# EAGLE design nanobone (EAGLE 7.5.0)

## Sheet 1 of 3
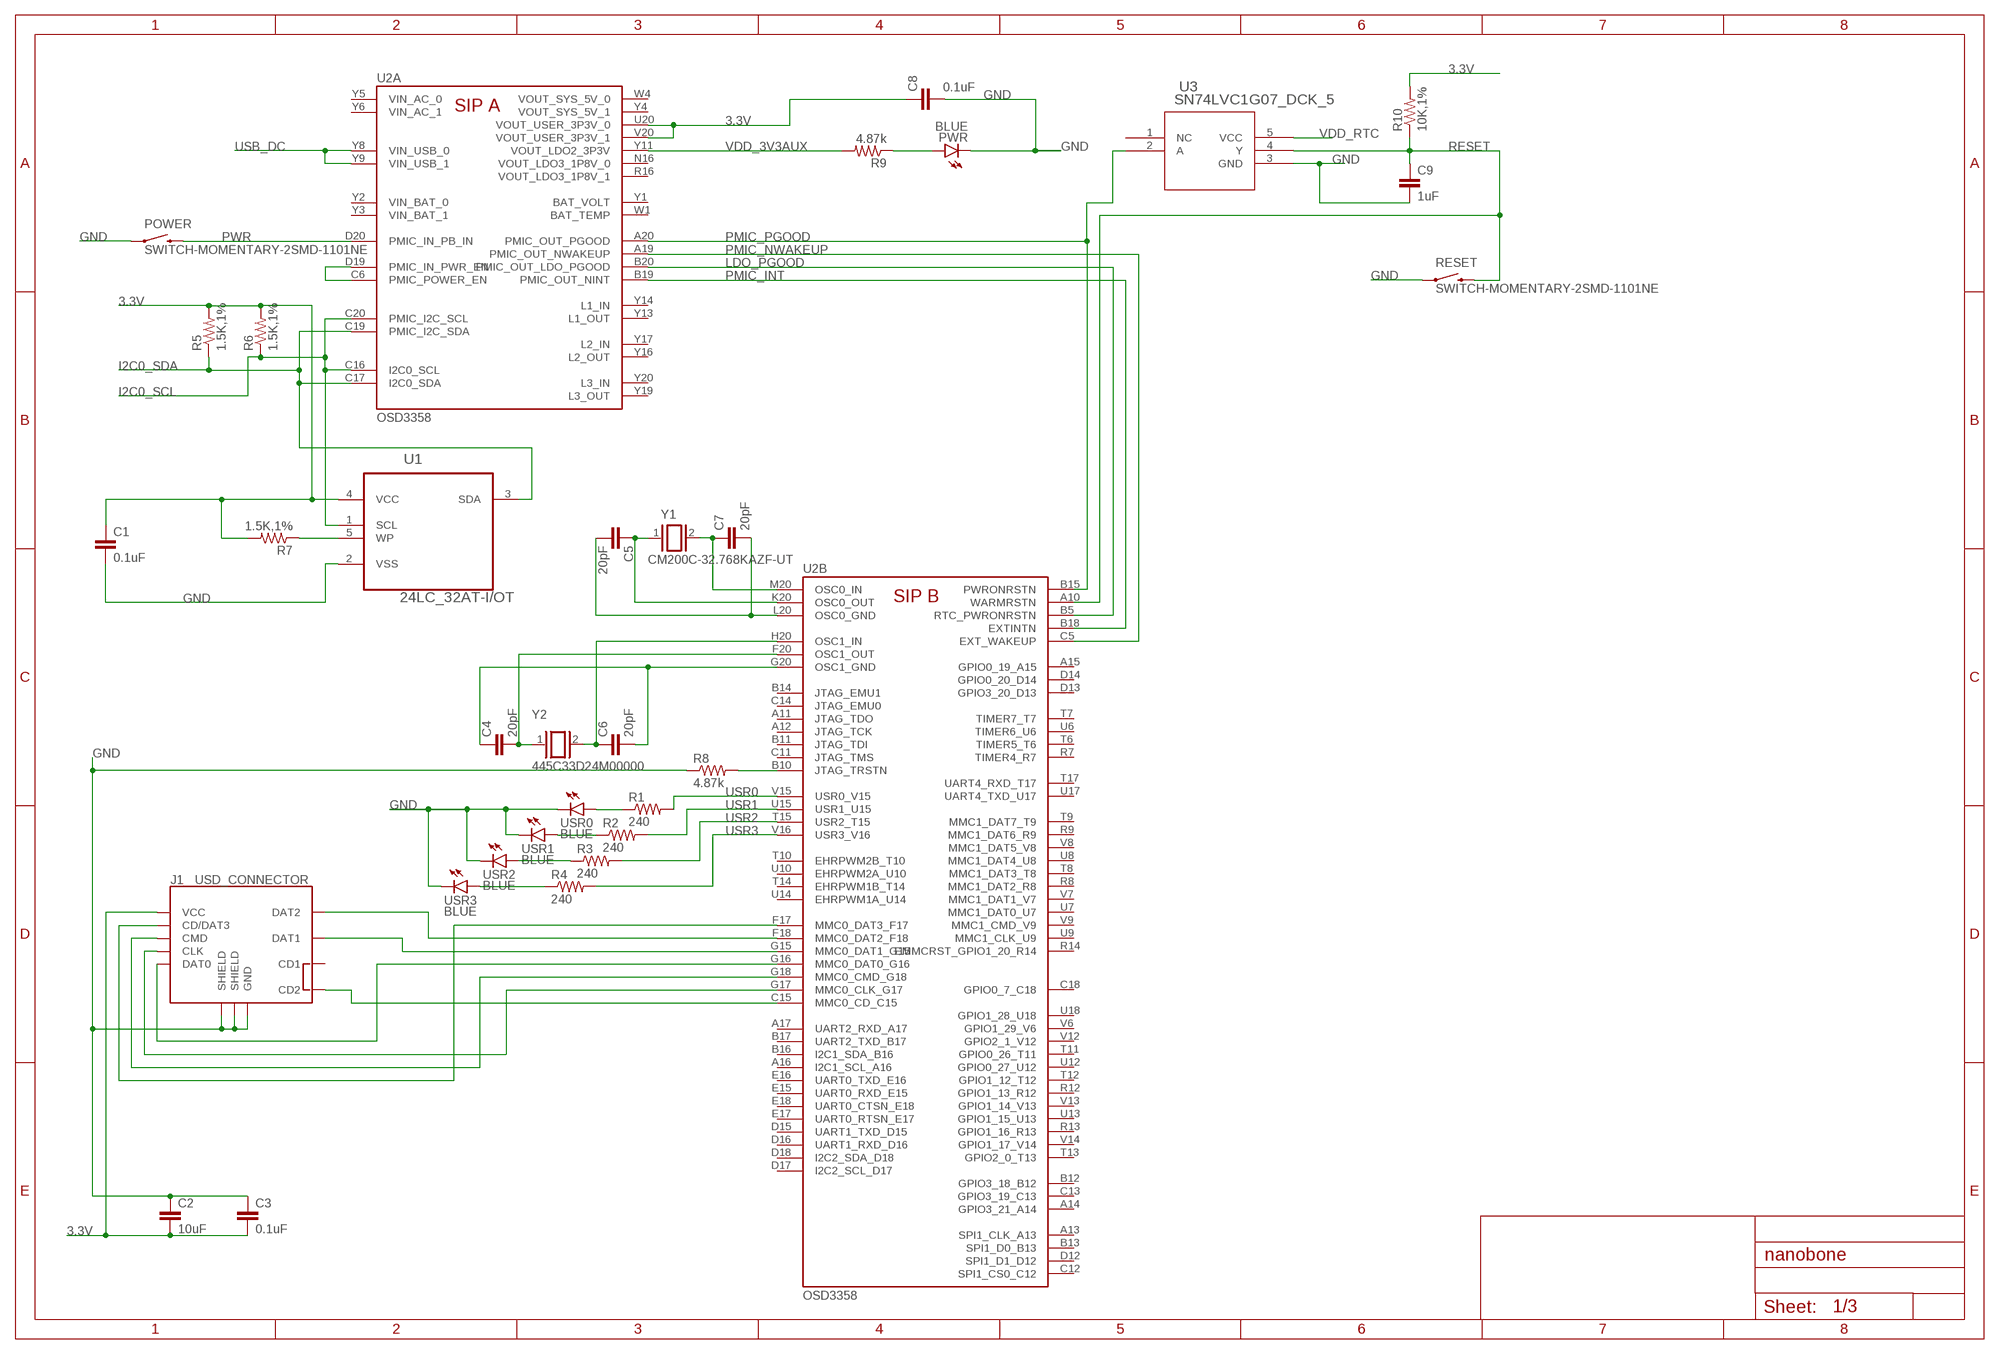
[diagram p0: schematic, sheet 1]

### Parts
C1  0.1uF  CAP0402-CAP  [0402-CAP]
C2  10uF  CAP0805  [0805]
C3  0.1uF  CAP0402-CAP  [0402-CAP]
C4  20pF  CAP0402-CAP  [0402-CAP]
C5  20pF  CAP0402-CAP  [0402-CAP]
C6  20pF  CAP0402-CAP  [0402-CAP]
C7  20pF  CAP0402-CAP  [0402-CAP]
C8  0.1uF  CAP0402-CAP  [0402-CAP]
C9  1uF  CAP0402-CAP  [0402-CAP]
J1  USD_CONNECTOR  [MICRO-SD-SOCKET-PP]
POWER  SWITCH-MOMENTARY-2SMD-1101NE  [TACTILE-SWITCH-1101NE]
PWR  BLUE  LED0402  [0402-LED]
R1  240  RESISTOR0402-RES  [0402-RES]
R2  240  RESISTOR0402-RES  [0402-RES]
R3  240  RESISTOR0402-RES  [0402-RES]
R4  240  RESISTOR0402-RES  [0402-RES]
R5  1.5K,1%  RESISTOR0402-RES  [0402-RES]
R6  1.5K,1%  RESISTOR0402-RES  [0402-RES]
R7  1.5K,1%  RESISTOR0402-RES  [0402-RES]
R8  4.87k  RESISTOR0402-RES  [0402-RES]
R9  4.87k  RESISTOR0402-RES  [0402-RES]
R10  10K,1%  RESISTOR0402-RES  [0402-RES]
RESET  SWITCH-MOMENTARY-2SMD-1101NE  [TACTILE-SWITCH-1101NE]
U1  24LC_32AT-I/OT  [SOT95P290X145-5N]
U2  OSD3358  [OSD3358]
U3  SN74LVC1G07_DCK_5  [DCK5]
USR0  BLUE  LED0402  [0402-LED]
USR1  BLUE  LED0402  [0402-LED]
USR2  BLUE  LED0402  [0402-LED]
USR3  BLUE  LED0402  [0402-LED]
Y1  CM200C-32.768KAZF-UT  [CM200C-32.768KAZF-UT]
Y2  445C33D24M00000  [445C33D24M00000]

### Nets
3.3V [power]: C1.1 C2.2 C3.2 C8.1 J1.VCC R5.2 R6.2 R7.2 R10.2 U1.4(VCC) U2.U20(A:VOUT_USER_3P3V_0) U2.V20(A:VOUT_USER_3P3V_1) ; also sheet 2
GND [ground]: C1.2 C2.1 C3.1 C8.2 C9.2 J1.GND J1.GND1(SHIELD) J1.GND3(SHIELD) POWER.1 PWR.C R8.1 RESET.1 U1.2(VSS) U3.3(GND) USR0.C USR1.C USR2.C USR3.C ; also sheet 2,3
I2C0_SCL: R6.1 U1.1(SCL) U2.C16(A:I2C0_SCL) U2.C20(A:PMIC_I2C_SCL)
I2C0_SDA: R5.1 U1.3(SDA) U2.C17(A:I2C0_SDA) U2.C19(A:PMIC_I2C_SDA)
LDO_PGOOD: U2.B5(B:RTC_PWRONRSTN) U2.B20(A:PMIC_OUT_LDO_PGOOD)
N$2: J1.CLK U2.G17(B:MMC0_CLK_G17)
N$5: J1.CD/DAT3 U2.F17(B:MMC0_DAT3_F17)
N$7: R8.2 U2.B10(B:JTAG_TRSTN)
N$8: R1.1 USR0.A
N$9: R2.1 USR1.A
N$10: R3.1 USR2.A
N$11: R4.1 USR3.A
N$12: U2.C6(A:PMIC_POWER_EN) U2.D19(A:PMIC_IN_PWR_EN)
N$13: PWR.A R9.1
N$26: C7.1 U2.M20(B:OSC0_IN) Y1.2
N$27: C5.1 U2.K20(B:OSC0_OUT) Y1.1
N$28: R7.1 U1.5(WP)
N$31: C5.2 C7.2 U2.L20(B:OSC0_GND)
N$32: C6.1 U2.H20(B:OSC1_IN) Y2.2
N$33: C4.2 U2.F20(B:OSC1_OUT) Y2.1
N$34: C4.1 C6.2 U2.G20(B:OSC1_GND)
N$70: J1.DAT1 U2.G15(B:MMC0_DAT1_G15)
N$74: J1.CMD U2.G18(B:MMC0_CMD_G18)
N$75: J1.CD2 U2.C15(B:MMC0_CD_C15)
N$77: J1.DAT0 U2.G16(B:MMC0_DAT0_G16)
NTE: J1.DAT2 U2.F18(B:MMC0_DAT2_F18)
PMIC_INT: U2.B18(B:EXTINTN) U2.B19(A:PMIC_OUT_NINT)
PMIC_NWAKEUP: U2.A19(A:PMIC_OUT_NWAKEUP) U2.C5(B:EXT_WAKEUP)
PMIC_PGOOD: U2.A20(A:PMIC_OUT_PGOOD) U2.B15(B:PWRONRSTN) U3.2(A)
PWR: POWER.2 U2.D20(A:PMIC_IN_PB_IN)
RESET: C9.1 R10.1 RESET.2 U2.A10(B:WARMRSTN) U3.4(Y)
USB_DC [power]: U2.Y8(A:VIN_USB_0) U2.Y9(A:VIN_USB_1) ; also sheet 2
USR0: R1.2 U2.V15(B:USR0_V15)
USR1: R2.2 U2.U15(B:USR1_U15)
USR2: R3.2 U2.T15(B:USR2_T15)
USR3: R4.2 U2.V16(B:USR3_V16)
VDD_3V3AUX: R9.2 U2.Y11(A:VOUT_LDO2_3P3V)
VDD_RTC: U3.5(VCC) ; also sheet 3
Unconnected: J1.CD1 U2.A11(B:JTAG_TDO) U2.A12(B:JTAG_TCK) U2.A13(B:SPI1_CLK_A13) U2.A14(B:GPIO3_21_A14) U2.A15(B:GPIO0_19_A15) U2.A16(B:I2C1_SCL_A16) U2.A17(B:UART2_RXD_A17) U2.B1(D:NC4) U2.B2(D:NC5) U2.B3(D:NC6) U2.B11(B:JTAG_TDI) U2.B12(B:GPIO3_18_B12) U2.B13(B:SPI1_D0_B13) U2.B14(B:JTAG_EMU1) U2.B16(B:I2C1_SDA_B16) U2.B17(B:UART2_TXD_B17) U2.C1(D:NC12) U2.C2(D:NC20) U2.C3(D:NC21) U2.C4(D:NC22) U2.C11(B:JTAG_TMS) U2.C12(B:SPI1_CS0_C12) U2.C13(B:GPIO3_19_C13) U2.C14(B:JTAG_EMU0) U2.C18(B:GPIO0_7_C18) U2.D1(D:NC24) U2.D2(D:NC31) U2.D3(D:NC32) U2.D4(D:NC33) U2.D5(D:NC34) U2.D12(B:SPI1_D1_D12) U2.D13(B:GPIO3_20_D13) U2.D14(B:GPIO0_20_D14) U2.D15(B:UART1_TXD_D15) U2.D16(B:UART1_RXD_D16) U2.D17(B:I2C2_SCL_D17) U2.D18(B:I2C2_SDA_D18) U2.E1(D:NC46) U2.E2(D:NC47) U2.E3(D:NC48) U2.E4(D:NC58) U2.E15(B:UART0_RXD_E15) U2.E16(B:UART0_TXD_E16) U2.E17(B:UART0_RTSN_E17) U2.E18(B:UART0_CTSN_E18) U2.F1(D:NC59) U2.F2(D:NC60) U2.F3(D:NC61) U2.F4(D:NC68) U2.G1(D:NC69) U2.G2(D:NC70) U2.G3(D:NC71) U2.G4(D:NC76) U2.H1(D:NC77) U2.H2(D:NC78) U2.H3(D:NC79) U2.H4(D:NC84) U2.J1(D:NC85) U2.J2(D:NC86) U2.J3(D:NC87) U2.J4(D:NC94) U2.K1(D:NC95) U2.K2(D:NC96) U2.K3(D:NC97) U2.K4(D:NC104) U2.L1(D:NC105) U2.L2(D:NC106) U2.L3(D:NC107) U2.L4(D:NC111) U2.M1(D:NC112) U2.M2(D:NC113) U2.M3(D:NC114) U2.M4(D:NC121) U2.N1(D:NC123) U2.N2(D:NC124) U2.N3(D:NC136) U2.N4(D:NC137) U2.P1(D:NC138) U2.P2(D:NC23) U2.P3(D:NC45) U2.P4(D:NC122) U2.R7(B:TIMER4_R7) U2.R8(B:MMC1_DAT2_R8) U2.R9(B:MMC1_DAT6_R9) U2.R12(B:GPIO1_13_R12) U2.R13(B:GPIO1_16_R13) U2.R14(B:EMMCRST_GPIO1_20_R14) U2.T6(B:TIMER5_T6) U2.T7(B:TIMER7_T7) U2.T8(B:MMC1_DAT3_T8) U2.T9(B:MMC1_DAT7_T9) U2.T10(B:EHRPWM2B_T10) U2.T11(B:GPIO0_26_T11) U2.T12(B:GPIO1_12_T12) U2.T13(B:GPIO2_0_T13) U2.T14(B:EHRPWM1B_T14) U2.T17(B:UART4_RXD_T17) U2.U6(B:TIMER6_U6) U2.U7(B:MMC1_DAT0_U7) U2.U8(B:MMC1_DAT4_U8) U2.U9(B:MMC1_CLK_U9) U2.U10(B:EHRPWM2A_U10) U2.U11(D:NC2) U2.U12(B:GPIO0_27_U12) U2.U13(B:GPIO1_15_U13) U2.U14(B:EHRPWM1A_U14) U2.U17(B:UART4_TXD_U17) U2.U18(B:GPIO1_28_U18) U2.V6(B:GPIO1_29_V6) U2.V7(B:MMC1_DAT1_V7) U2.V8(B:MMC1_DAT5_V8) U2.V9(B:MMC1_CMD_V9) U2.V10(D:NC3) U2.V11(D:NC1) U2.V12(B:GPIO2_1_V12) U2.V13(B:GPIO1_14_V13) U2.V14(B:GPIO1_17_V14) U2.W1(A:BAT_TEMP) U2.Y1(A:BAT_VOLT) U2.Y13(A:L1_OUT) U2.Y14(A:L1_IN) U2.Y16(A:L2_OUT) U2.Y17(A:L2_IN) U2.Y19(A:L3_OUT) U2.Y20(A:L3_IN) U3.1(NC)

## Sheet 2 of 3
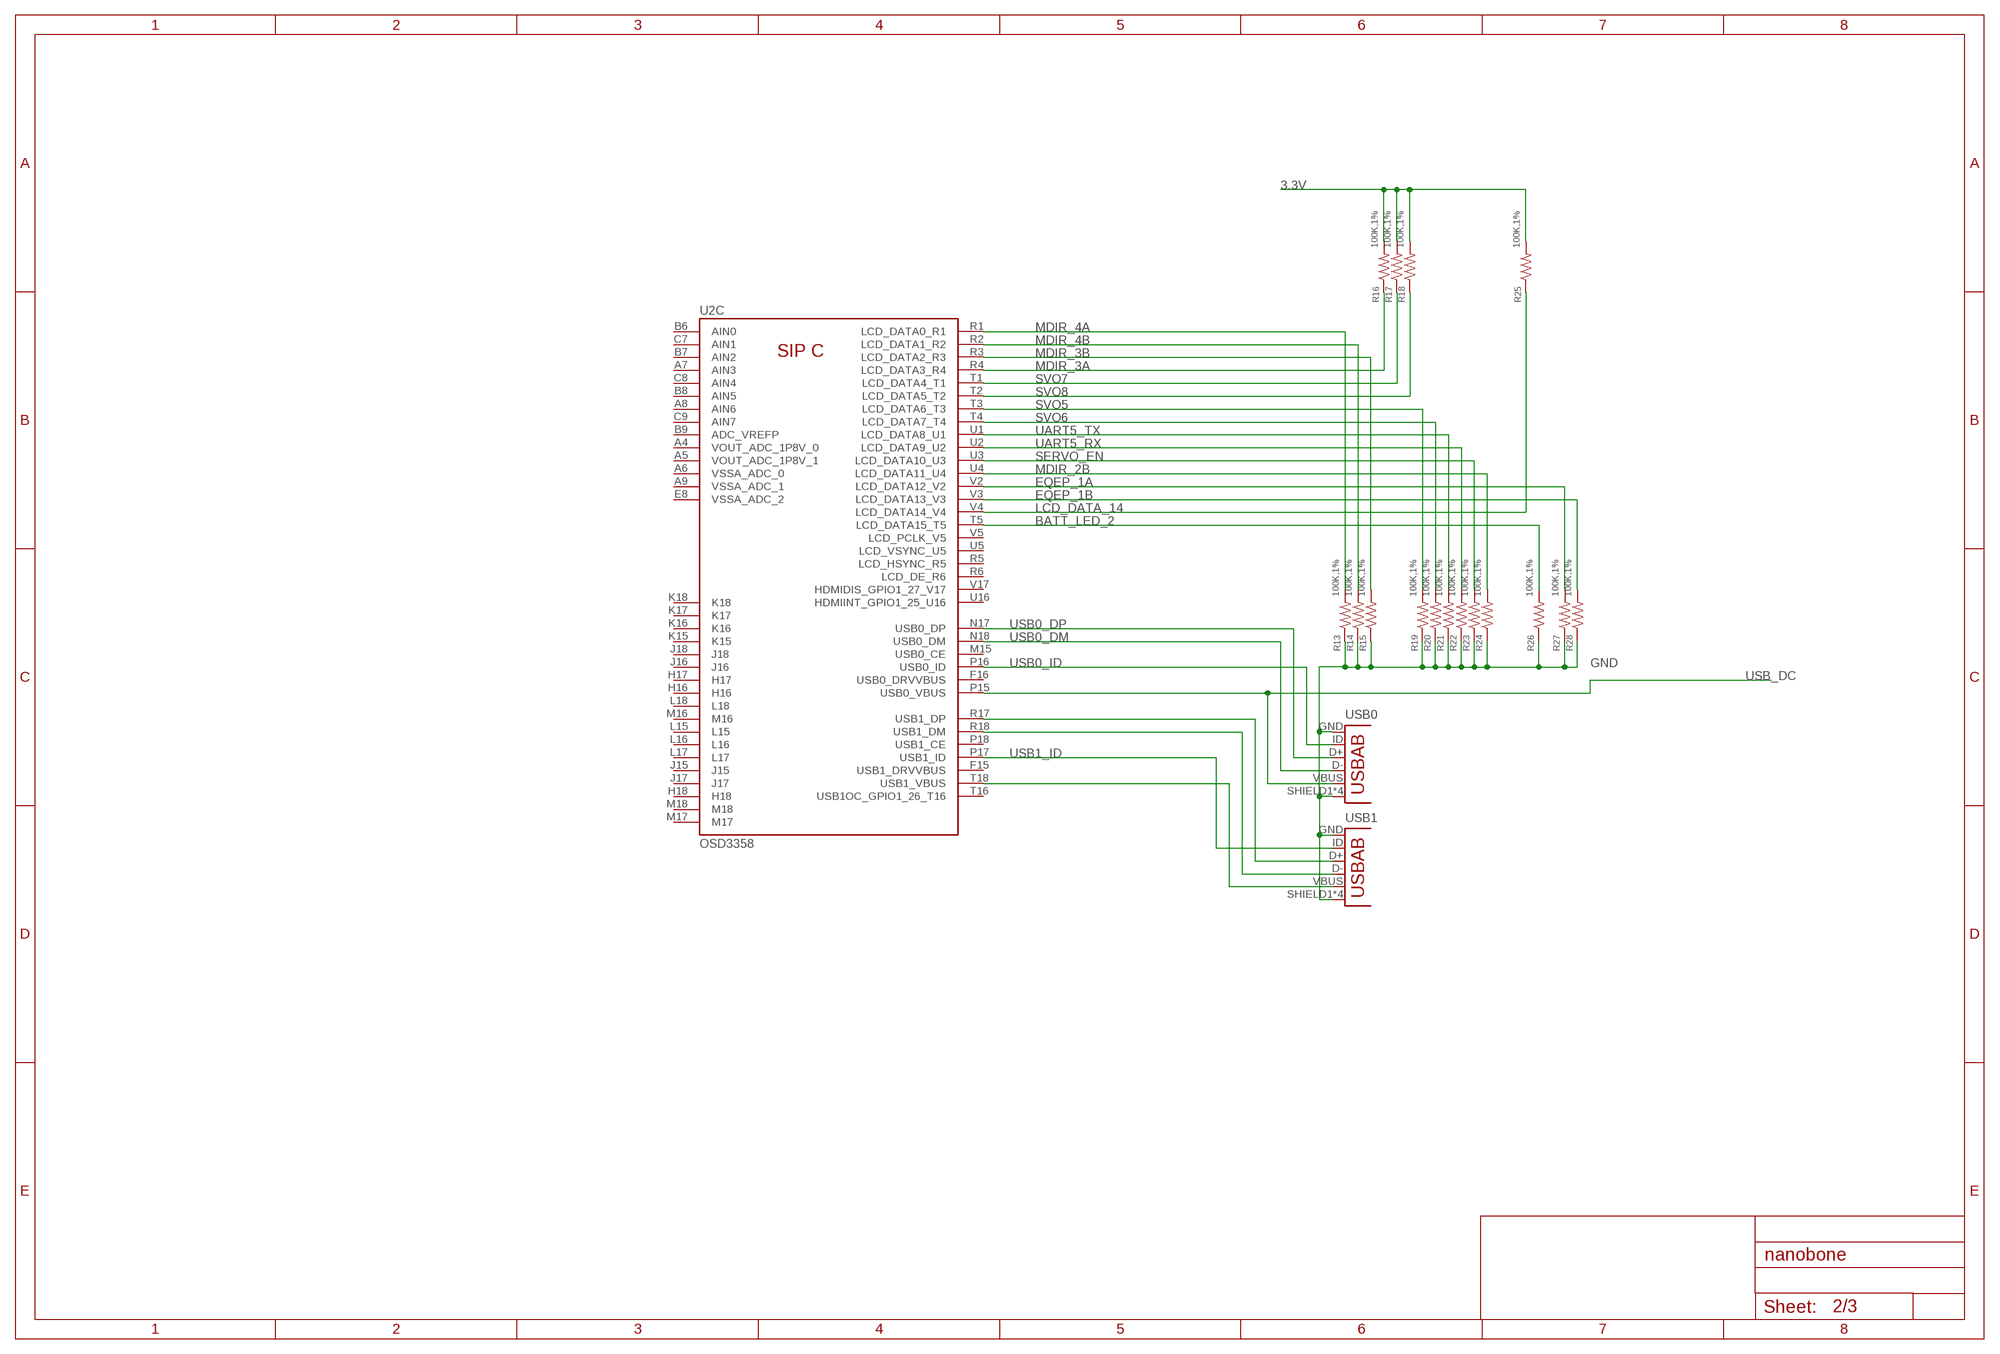
[diagram p1: schematic, sheet 2]

### Parts
R13  100K,1%  RESISTOR0402-RES  [0402-RES]
R14  100K,1%  RESISTOR0402-RES  [0402-RES]
R15  100K,1%  RESISTOR0402-RES  [0402-RES]
R16  100K,1%  RESISTOR0402-RES  [0402-RES]
R17  100K,1%  RESISTOR0402-RES  [0402-RES]
R18  100K,1%  RESISTOR0402-RES  [0402-RES]
R19  100K,1%  RESISTOR0402-RES  [0402-RES]
R20  100K,1%  RESISTOR0402-RES  [0402-RES]
R21  100K,1%  RESISTOR0402-RES  [0402-RES]
R22  100K,1%  RESISTOR0402-RES  [0402-RES]
R23  100K,1%  RESISTOR0402-RES  [0402-RES]
R24  100K,1%  RESISTOR0402-RES  [0402-RES]
R25  100K,1%  RESISTOR0402-RES  [0402-RES]
R26  100K,1%  RESISTOR0402-RES  [0402-RES]
R27  100K,1%  RESISTOR0402-RES  [0402-RES]
R28  100K,1%  RESISTOR0402-RES  [0402-RES]
USB0  USB-AB  [USB-AB-MICRO-SMD]
USB1  USB-AB  [USB-AB-MICRO-SMD]

### Nets
3.3V [power]: R16.2 R17.2 R18.2 R25.2 ; also sheet 1
BATT_LED_2: R26.2 U2.T5(C:LCD_DATA15_T5)
EQEP_1A: R27.2 U2.V2(C:LCD_DATA12_V2)
EQEP_1B: R28.2 U2.V3(C:LCD_DATA13_V3)
GND [ground]: R13.1 R14.1 R15.1 R19.1 R20.1 R21.1 R22.1 R23.1 R24.1 R26.1 R27.1 R28.1 USB0.GND USB0.SHIELD1(SHIELD) USB0.SHIELD2(SHIELD) USB0.SHIELD3(SHIELD) USB0.SHIELD4(SHIELD) USB1.GND USB1.SHIELD1(SHIELD) USB1.SHIELD2(SHIELD) USB1.SHIELD3(SHIELD) USB1.SHIELD4(SHIELD) ; also sheet 1,3
LCD_DATA_14: R25.1 U2.V4(C:LCD_DATA14_V4)
MDIR_2B: R24.2 U2.U4(C:LCD_DATA11_U4)
MDIR_3A: R16.1 U2.R4(C:LCD_DATA3_R4)
MDIR_3B: R15.2 U2.R3(C:LCD_DATA2_R3)
MDIR_4A: R13.2 U2.R1(C:LCD_DATA0_R1)
MDIR_4B: R14.2 U2.R2(C:LCD_DATA1_R2)
N$1: U2.R17(C:USB1_DP) USB1.D+
N$4: U2.R18(C:USB1_DM) USB1.D-
N$6: U2.T18(C:USB1_VBUS) USB1.VBUS
SERVO_EN: R23.2 U2.U3(C:LCD_DATA10_U3)
SVO5: R19.2 U2.T3(C:LCD_DATA6_T3)
SVO6: R20.2 U2.T4(C:LCD_DATA7_T4)
SVO7: R17.1 U2.T1(C:LCD_DATA4_T1)
SVO8: R18.1 U2.T2(C:LCD_DATA5_T2)
UART5_RX: R22.2 U2.U2(C:LCD_DATA9_U2)
UART5_TX: R21.2 U2.U1(C:LCD_DATA8_U1)
USB0_DM [usb]: U2.N18(C:USB0_DM) USB0.D-
USB0_DP [usb]: U2.N17(C:USB0_DP) USB0.D+
USB0_ID: U2.P16(C:USB0_ID) USB0.ID(USBID)
USB1_ID: U2.P17(C:USB1_ID) USB1.ID(USBID)
USB_DC [power]: U2.P15(C:USB0_VBUS) USB0.VBUS ; also sheet 1
Unconnected: U2.A4(C:VOUT_ADC_1P8V_0) U2.A5(C:VOUT_ADC_1P8V_1) U2.A6(C:VSSA_ADC_0) U2.A7(C:AIN3) U2.A8(C:AIN6) U2.A9(C:VSSA_ADC_1) U2.B6(C:AIN0) U2.B7(C:AIN2) U2.B8(C:AIN5) U2.B9(C:ADC_VREFP) U2.C7(C:AIN1) U2.C8(C:AIN4) U2.C9(C:AIN7) U2.E8(C:VSSA_ADC_2) U2.F15(C:USB1_DRVVBUS) U2.F16(C:USB0_DRVVBUS) U2.H16(C:H16) U2.H17(C:H17) U2.H18(C:H18) U2.J15(C:J15) U2.J16(C:J16) U2.J17(C:J17) U2.J18(C:J18) U2.K15(C:K15) U2.K16(C:K16) U2.K17(C:K17) U2.K18(C:K18) U2.L15(C:L15) U2.L16(C:L16) U2.L17(C:L17) U2.L18(C:L18) U2.M15(C:USB0_CE) U2.M16(C:M16) U2.M17(C:M17) U2.M18(C:M18) U2.P18(C:USB1_CE) U2.R5(C:LCD_HSYNC_R5) U2.R6(C:LCD_DE_R6) U2.T16(C:USB1OC_GPIO1_26_T16) U2.U5(C:LCD_VSYNC_U5) U2.U16(C:HDMIINT_GPIO1_25_U16) U2.V5(C:LCD_PCLK_V5) U2.V17(C:HDMIDIS_GPIO1_27_V17)

## Sheet 3 of 3
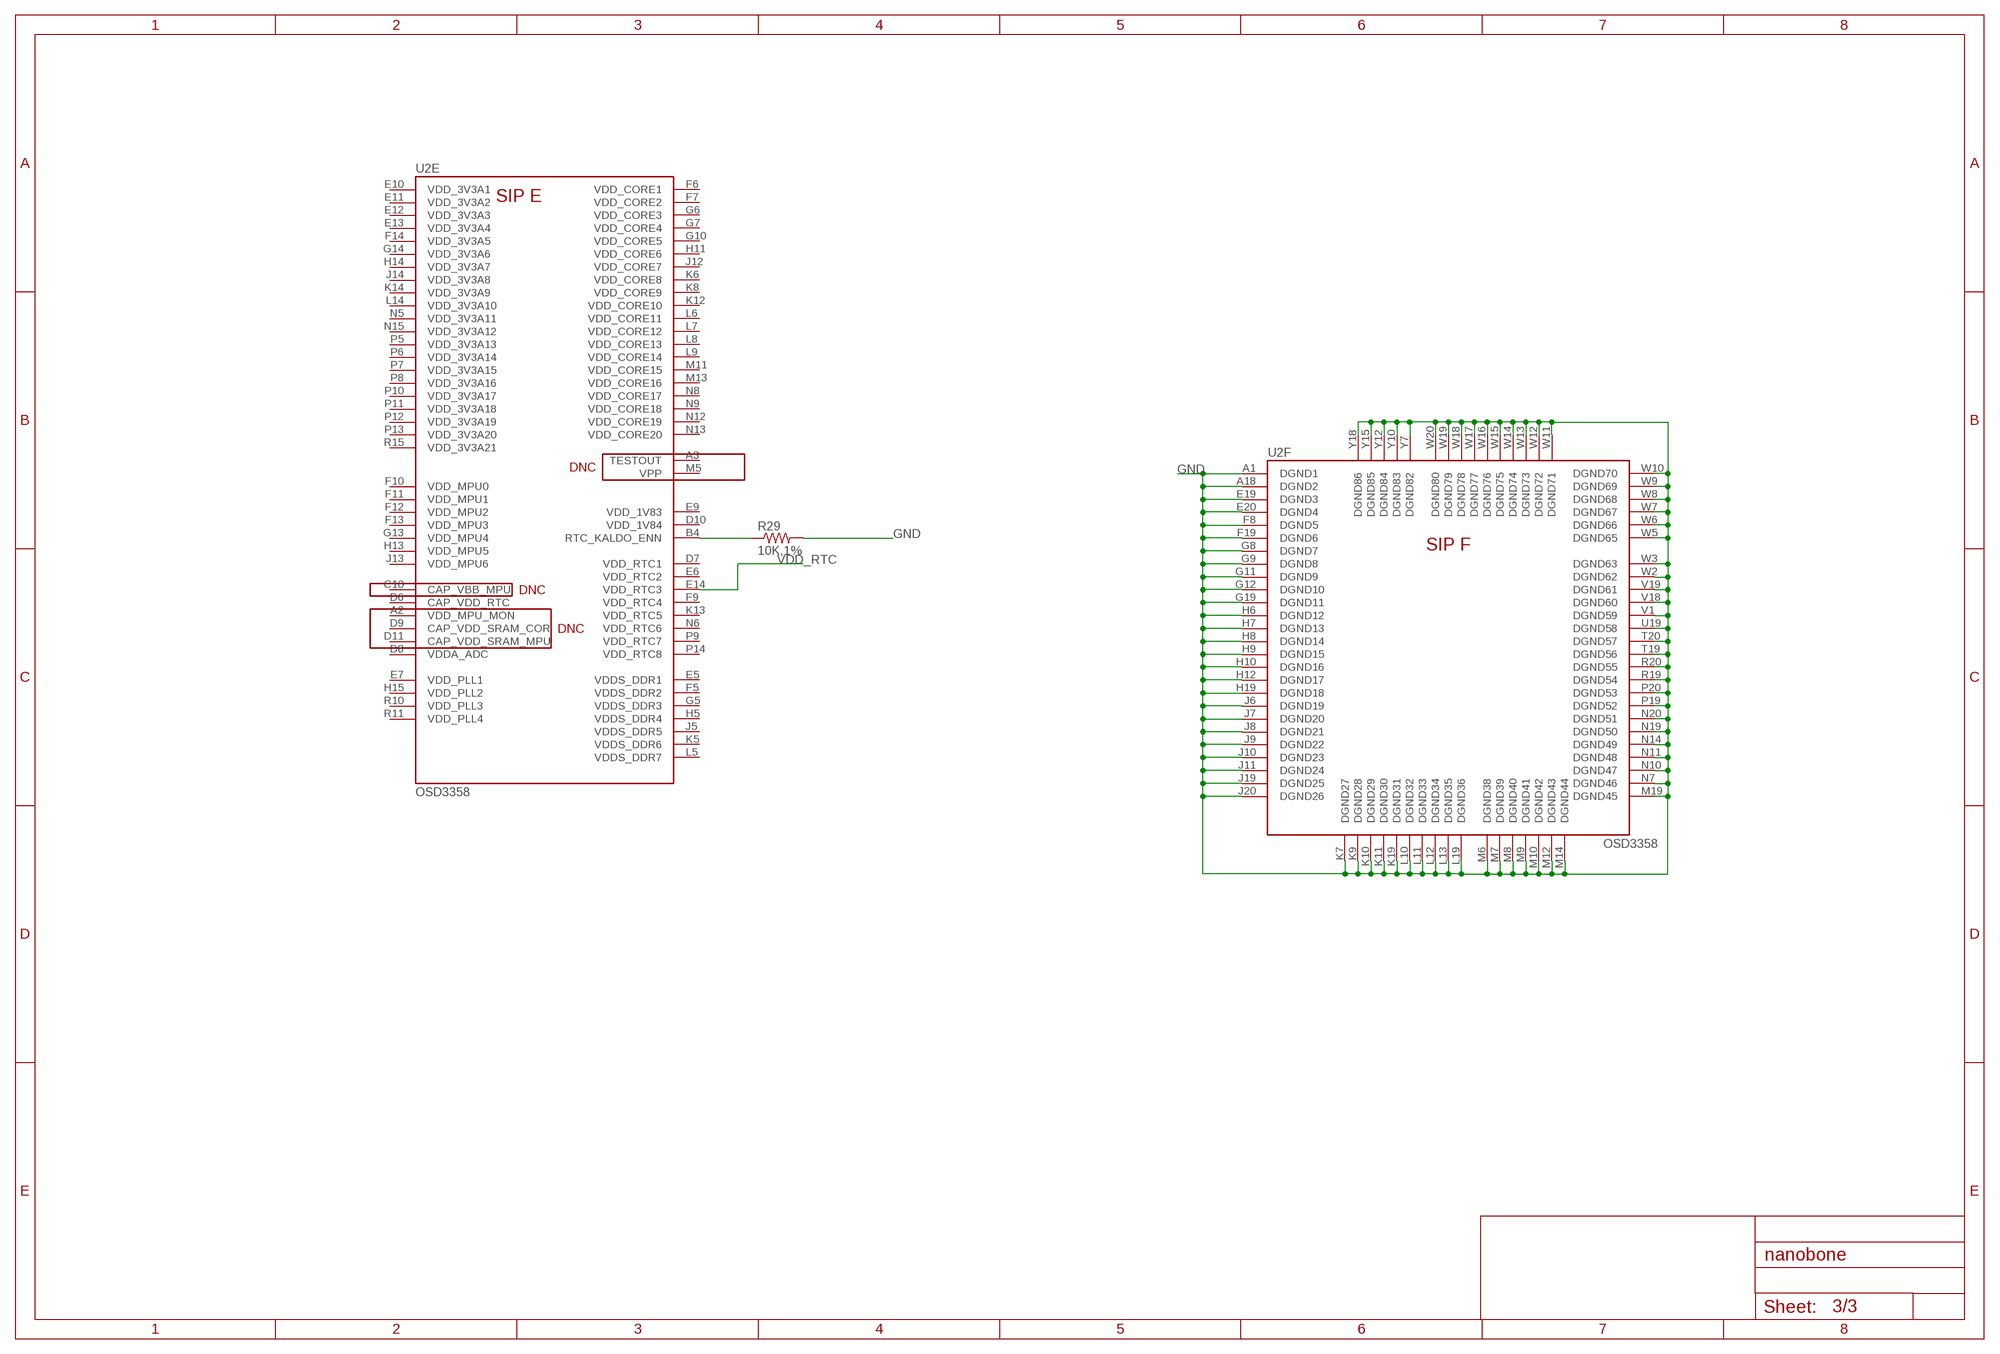
[diagram p2: schematic, sheet 3]

### Parts
R29  10K,1%  RESISTOR0402-RES  [0402-RES]

### Nets
GND [ground]: R29.2 U2.A1(F:DGND1) U2.A18(F:DGND2) U2.E19(F:DGND3) U2.E20(F:DGND4) U2.F8(F:DGND5) U2.F19(F:DGND6) U2.G8(F:DGND7) U2.G9(F:DGND8) U2.G11(F:DGND9) U2.G12(F:DGND10) U2.G19(F:DGND11) U2.H6(F:DGND12) U2.H7(F:DGND13) U2.H8(F:DGND14) U2.H9(F:DGND15) U2.H10(F:DGND16) U2.H12(F:DGND17) U2.H19(F:DGND18) U2.J6(F:DGND19) U2.J7(F:DGND20) U2.J8(F:DGND21) U2.J9(F:DGND22) U2.J10(F:DGND23) U2.J11(F:DGND24) U2.J19(F:DGND25) U2.J20(F:DGND26) U2.K7(F:DGND27) U2.K9(F:DGND28) U2.K10(F:DGND29) U2.K11(F:DGND30) U2.K19(F:DGND31) U2.L10(F:DGND32) U2.L11(F:DGND33) U2.L12(F:DGND34) U2.L13(F:DGND35) U2.L19(F:DGND36) U2.M6(F:DGND38) U2.M7(F:DGND39) U2.M8(F:DGND40) U2.M9(F:DGND41) U2.M10(F:DGND42) U2.M12(F:DGND43) U2.M14(F:DGND44) U2.M19(F:DGND45) U2.N7(F:DGND46) U2.N10(F:DGND47) U2.N11(F:DGND48) U2.N14(F:DGND49) U2.N19(F:DGND50) U2.N20(F:DGND51) U2.P19(F:DGND52) U2.P20(F:DGND53) U2.R19(F:DGND54) U2.R20(F:DGND55) U2.T19(F:DGND56) U2.T20(F:DGND57) U2.U19(F:DGND58) U2.V1(F:DGND59) U2.V18(F:DGND60) U2.V19(F:DGND61) U2.W2(F:DGND62) U2.W3(F:DGND63) U2.W5(F:DGND65) U2.W6(F:DGND66) U2.W7(F:DGND67) U2.W8(F:DGND68) U2.W9(F:DGND69) U2.W10(F:DGND70) U2.W11(F:DGND71) U2.W12(F:DGND72) U2.W13(F:DGND73) U2.W14(F:DGND74) U2.W15(F:DGND75) U2.W16(F:DGND76) U2.W17(F:DGND77) U2.W18(F:DGND78) U2.W19(F:DGND79) U2.W20(F:DGND80) U2.Y7(F:DGND82) U2.Y10(F:DGND83) U2.Y12(F:DGND84) U2.Y15(F:DGND85) U2.Y18(F:DGND86) ; also sheet 1,2
N$131: R29.1 U2.B4(E:RTC_KALDO_ENN)
VDD_RTC: U2.E14(E:VDD_RTC3) ; also sheet 1
Unconnected: U2.A2(E:VDD_MPU_MON) U2.A3(E:TESTOUT) U2.C10(E:CAP_VBB_MPU) U2.D6(E:CAP_VDD_RTC) U2.D7(E:VDD_RTC1) U2.D8(E:VDDA_ADC) U2.D9(E:CAP_VDD_SRAM_COR) U2.D10(E:VDD_1V84) U2.D11(E:CAP_VDD_SRAM_MPU) U2.E5(E:VDDS_DDR1) U2.E6(E:VDD_RTC2) U2.E7(E:VDD_PLL1) U2.E9(E:VDD_1V83) U2.E10(E:VDD_3V3A1) U2.E11(E:VDD_3V3A2) U2.E12(E:VDD_3V3A3) U2.E13(E:VDD_3V3A4) U2.F5(E:VDDS_DDR2) U2.F6(E:VDD_CORE1) U2.F7(E:VDD_CORE2) U2.F9(E:VDD_RTC4) U2.F10(E:VDD_MPU0) U2.F11(E:VDD_MPU1) U2.F12(E:VDD_MPU2) U2.F13(E:VDD_MPU3) U2.F14(E:VDD_3V3A5) U2.G5(E:VDDS_DDR3) U2.G6(E:VDD_CORE3) U2.G7(E:VDD_CORE4) U2.G10(E:VDD_CORE5) U2.G13(E:VDD_MPU4) U2.G14(E:VDD_3V3A6) U2.H5(E:VDDS_DDR4) U2.H11(E:VDD_CORE6) U2.H13(E:VDD_MPU5) U2.H14(E:VDD_3V3A7) U2.H15(E:VDD_PLL2) U2.J5(E:VDDS_DDR5) U2.J12(E:VDD_CORE7) U2.J13(E:VDD_MPU6) U2.J14(E:VDD_3V3A8) U2.K5(E:VDDS_DDR6) U2.K6(E:VDD_CORE8) U2.K8(E:VDD_CORE9) U2.K12(E:VDD_CORE10) U2.K13(E:VDD_RTC5) U2.K14(E:VDD_3V3A9) U2.L5(E:VDDS_DDR7) U2.L6(E:VDD_CORE11) U2.L7(E:VDD_CORE12) U2.L8(E:VDD_CORE13) U2.L9(E:VDD_CORE14) U2.L14(E:VDD_3V3A10) U2.M5(E:VPP) U2.M11(E:VDD_CORE15) U2.M13(E:VDD_CORE16) U2.N5(E:VDD_3V3A11) U2.N6(E:VDD_RTC6) U2.N8(E:VDD_CORE17) U2.N9(E:VDD_CORE18) U2.N12(E:VDD_CORE19) U2.N13(E:VDD_CORE20) U2.N15(E:VDD_3V3A12) U2.P5(E:VDD_3V3A13) U2.P6(E:VDD_3V3A14) U2.P7(E:VDD_3V3A15) U2.P8(E:VDD_3V3A16) U2.P9(E:VDD_RTC7) U2.P10(E:VDD_3V3A17) U2.P11(E:VDD_3V3A18) U2.P12(E:VDD_3V3A19) U2.P13(E:VDD_3V3A20) U2.P14(E:VDD_RTC8) U2.R10(E:VDD_PLL3) U2.R11(E:VDD_PLL4) U2.R15(E:VDD_3V3A21)

## Power pins joined to a net without a drawn wire
VIN_AC_0: U2.Y5(A:VIN_AC_0)
VIN_AC_1: U2.Y6(A:VIN_AC_1)
VIN_BAT_0: U2.Y2(A:VIN_BAT_0)
VIN_BAT_1: U2.Y3(A:VIN_BAT_1)
VOUT_LDO3_1P8V_0: U2.N16(A:VOUT_LDO3_1P8V_0)
VOUT_LDO3_1P8V_1: U2.R16(A:VOUT_LDO3_1P8V_1)
VOUT_SYS_5V_0: U2.W4(A:VOUT_SYS_5V_0)
VOUT_SYS_5V_1: U2.Y4(A:VOUT_SYS_5V_1)

## Library data of the parts
C1-C9 = Strawson_Eagle_Lib:CAP: Capacitor Standard 0603 ceramic capacitor, and 0.1" leaded capacitor.
J1 = pocketbone:USD_CONNECTOR: microSD Socket Push-push type µSD socket. Footprint production proven. Symbol has new and improved layout and naming accuracy. SparkFun Electronics SKU : PRT-00127. tDoc lines correctly indicate media card edge positions when inserting (unlocked, locked, depressed). NOTE: CD1 and CD2 are connected internally; PROD_ID: CONN-07820
POWER RESET = SparkFun-Electromechanical:SWITCH-MOMENTARY-2: Various NO switches- pushbuttons, reed, etc; PROD_ID: SWCH-00815
PWR USR0 USR1-USR3 = nanobone:LED: LEDs Standard schematic elements and footprints for 5mm, 3mm, 1206, and 0603 sized LEDs. 5mm - Spark Fun Electronics SKU : COM-00529 (and others)
R1-R10 R13-R29 = Strawson_Eagle_Lib:RESISTOR: Resistor Basic schematic elements and footprints for 0603, 1206, and PTH resistors.
U1 = pocketbone:24LC_: IC, I2C Serial EEPROM,SOT-23-5; MPN: 24LC32AT-I/OT; OC_FARNELL: 1700993; OC_NEWARK: 08P0113; PACKAGE: SOT-23-5; SUPPLIER: MICROCHIP
U2 = pocketbone:OSD3358: Octavo Systems LLC - OSD3358 Rev A
U3 = pocketbone:SN74LVC1G07_DCK_5; DATASHEETURL: http://www.ti.com/lit/gpn/SN74LVC1G07; DESCRIPTION: Single Buffer/Driver With Open-Drain Output; FAMILY_NAME: LL BUFFER AND DRIVER WITH OPEN-DRAIN OUTPUT; GENERIC_PART_NUMBER: SN74LVC1G07; INDUSTRY_STD_PKG_TYPE: SC70; MANUFACTURER: Texas Instruments; MANUFACTURER_PART_NUMBER: sn74lvc1g07_dck_5; PACKAGE_DESIGNATOR: DCK; PIN_COUNT: 5; VENDOR: Texas Instruments
USB0 USB1 = pocketbone:USB-AB: This is a USB AB connector that is compatible with USB OTG. i.e. this connector can serve as a host or device
Y1 = pocketbone:CM200C-32.768KAZF-UT
Y2 = pocketbone:445C33D24M00000

## Net classes
0 default: width 0.152 mm, drill 0.33 mm, clearance 0.152 mm
1 ground: width 0.33 mm, drill 0.33 mm, clearance 0.152 mm
2 usb: width 0.152 mm, clearance 0.152 mm
3 power: width 0.33 mm, drill 0.33 mm, clearance 0.152 mm

## Board
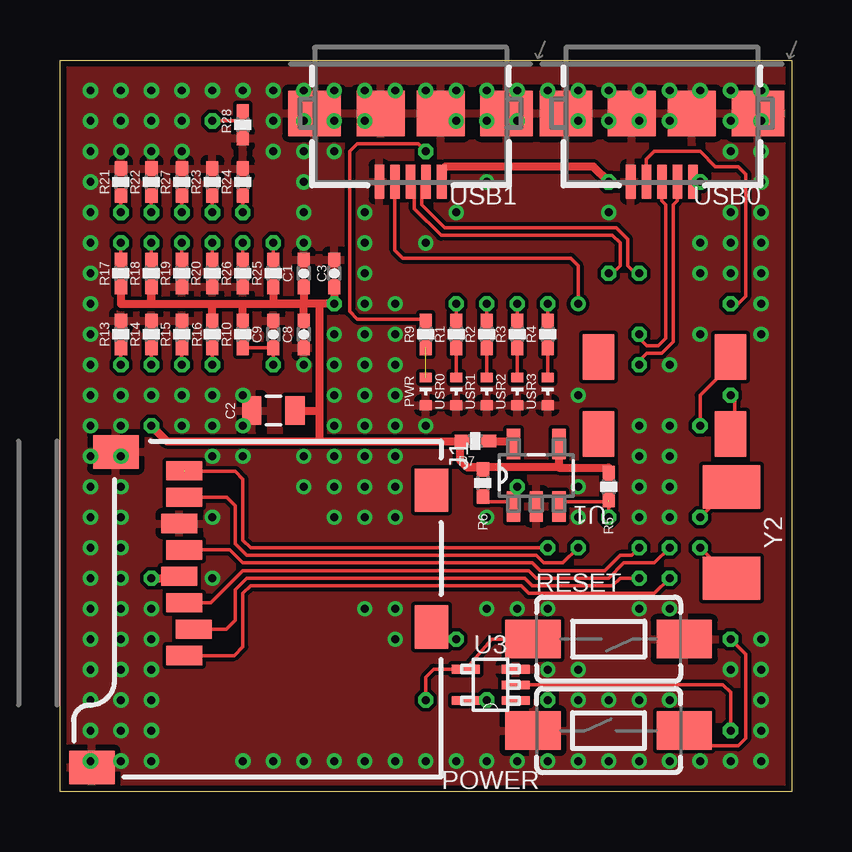
[diagram p3: board, top side]
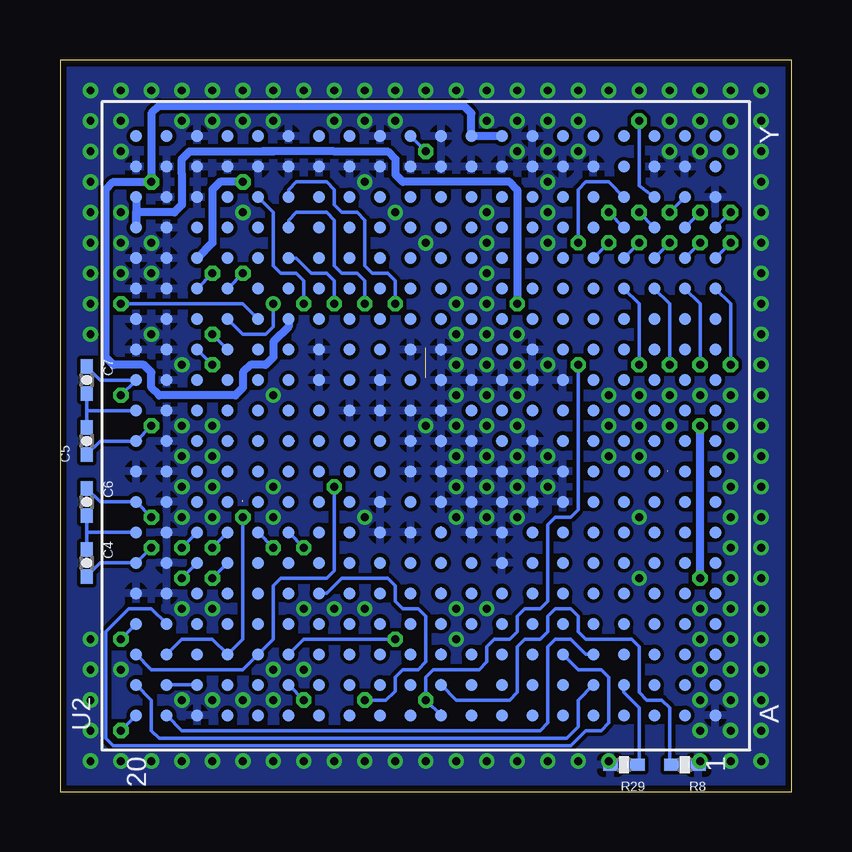
[diagram p4: board, bottom side, seen from below]

Size 30.48 x 30.48 mm. Coordinates in mm from the lower left corner, seen from the top.
Outline: 30.48,0 0,0 0,30.48 30.48,30.48 30.48,0
Copper layers (1*16): Top 0.035mm / dielectric 1.5mm / Bottom 0.035mm
Design rules "SeeedStudio_2layer_DRU_no_angle_20140221": minimum track width 6mil, minimum drill 12mil, track to track 6mil, track to pad 6mil, pad to pad 6mil, via to via 6mil, smd to smd 0mil, copper to edge 10mil, drill to drill 10mil, minimum pad ring 10mil, minimum via ring 6mil, stop-mask expansion 2mil, vias tented up to drill 100mil, thermal gap 10mil

### Footprints (pad centres in the part's own frame; a part is rotated, then mirrored left to right if it is on the bottom)
0402-CAP = smd 0.61 x 0.508: 1 -0.559,0; 2 0.559,0
0805 = smd 0.8 x 1.2: 1 -0.9,0; 2 0.9,0
MICRO-SD-SOCKET-PP = smd 1.8 x 1.4: CD1 -2.05,0.4; CD2 -7.75,0.4 | smd 0.8 x 1.5: CD/DAT3 -7.84,10.3; CLK -4.54,10.7; CMD -6.74,10.7; DAT0 -2.34,10.7; DAT1 -1.24,10.7; DAT2 -8.94,10.7; GND -3.44,10.9; VCC -5.64,10.9 | smd 1.4 x 1.9: GND1 -13.6,14.55; GND3 -0.45,13.55
TACTILE-SWITCH-1101NE = smd 2.3 x 1.6: 1 -3.15,0; 2 3.15,0
0402-LED = smd 0.4 x 0.5: A -0.575,0; C 0.575,0
0402-RES = smd 0.61 x 0.508: 1 -0.559,0; 2 0.559,0
SOT95P290X145-5N = smd 1.27 x 0.559: 1 -1.295,0.94; 2 -1.295,0; 3 -1.295,-0.94; 4 1.295,-0.94; 5 1.295,0.94
OSD3358 = smd 0.5 x 0.5: A1 -12.065,-12.065; A2 -12.065,-10.795; A3 -12.065,-9.525; A4 -12.065,-8.255; A5 -12.065,-6.985; A6 -12.065,-5.715; A7 -12.065,-4.445; A8 -12.065,-3.175; A9 -12.065,-1.905; A10 -12.065,-0.635; A11 -12.065,0.635; A12 -12.065,1.905; A13 -12.065,3.175; A14 -12.065,4.445; A15 -12.065,5.715; A16 -12.065,6.985; A17 -12.065,8.255; A18 -12.065,9.525; A19 -12.065,10.795; A20 -12.065,12.065; B1 -10.795,-12.065; B2 -10.795,-10.795; B3 -10.795,-9.525; B4 -10.795,-8.255; B5 -10.795,-6.985; B6 -10.795,-5.715; B7 -10.795,-4.445; B8 -10.795,-3.175; B9 -10.795,-1.905; B10 -10.795,-0.635; B11 -10.795,0.635; B12 -10.795,1.905; B13 -10.795,3.175; B14 -10.795,4.445; B15 -10.795,5.715; B16 -10.795,6.985; B17 -10.795,8.255; B18 -10.795,9.525; B19 -10.795,10.795; B20 -10.795,12.065; C1 -9.525,-12.065; C2 -9.525,-10.795; C3 -9.525,-9.525; C4 -9.525,-8.255; C5 -9.525,-6.985; C6 -9.525,-5.715; C7 -9.525,-4.445; C8 -9.525,-3.175; C9 -9.525,-1.905; C10 -9.525,-0.635; C11 -9.525,0.635; C12 -9.525,1.905; C13 -9.525,3.175; C14 -9.525,4.445; C15 -9.525,5.715; C16 -9.525,6.985; C17 -9.525,8.255; C18 -9.525,9.525; C19 -9.525,10.795; C20 -9.525,12.065; D1 -8.255,-12.065; D2 -8.255,-10.795; D3 -8.255,-9.525; D4 -8.255,-8.255; D5 -8.255,-6.985; D6 -8.255,-5.715; D7 -8.255,-4.445; D8 -8.255,-3.175; D9 -8.255,-1.905; D10 -8.255,-0.635; D11 -8.255,0.635; D12 -8.255,1.905; D13 -8.255,3.175; D14 -8.255,4.445; D15 -8.255,5.715; D16 -8.255,6.985; D17 -8.255,8.255; D18 -8.255,9.525; D19 -8.255,10.795; D20 -8.255,12.065; E1 -6.985,-12.065; E2 -6.985,-10.795; E3 -6.985,-9.525; E4 -6.985,-8.255; E5 -6.985,-6.985; E6 -6.985,-5.715; E7 -6.985,-4.445; E8 -6.985,-3.175; E9 -6.985,-1.905; E10 -6.985,-0.635; E11 -6.985,0.635; E12 -6.985,1.905; E13 -6.985,3.175; E14 -6.985,4.445; E15 -6.985,5.715; E16 -6.985,6.985; E17 -6.985,8.255; E18 -6.985,9.525; E19 -6.985,10.795; E20 -6.985,12.065; F1 -5.715,-12.065; F2 -5.715,-10.795; F3 -5.715,-9.525; F4 -5.715,-8.255; F5 -5.715,-6.985; F6 -5.715,-5.715; F7 -5.715,-4.445; F8 -5.715,-3.175; F9 -5.715,-1.905; F10 -5.715,-0.635; F11 -5.715,0.635; F12 -5.715,1.905; F13 -5.715,3.175; F14 -5.715,4.445; F15 -5.715,5.715; F16 -5.715,6.985; F17 -5.715,8.255; F18 -5.715,9.525; F19 -5.715,10.795; F20 -5.715,12.065; G1 -4.445,-12.065; G2 -4.445,-10.795; G3 -4.445,-9.525; G4 -4.445,-8.255; G5 -4.445,-6.985; G6 -4.445,-5.715; G7 -4.445,-4.445; G8 -4.445,-3.175; G9 -4.445,-1.905; G10 -4.445,-0.635; G11 -4.445,0.635; G12 -4.445,1.905; G13 -4.445,3.175; G14 -4.445,4.445; G15 -4.445,5.715; G16 -4.445,6.985; G17 -4.445,8.255; G18 -4.445,9.525; G19 -4.445,10.795; G20 -4.445,12.065; H1 -3.175,-12.065; H2 -3.175,-10.795; H3 -3.175,-9.525; H4 -3.175,-8.255; H5 -3.175,-6.985; H6 -3.175,-5.715; H7 -3.175,-4.445; H8 -3.175,-3.175; H9 -3.175,-1.905; H10 -3.175,-0.635; H11 -3.175,0.635; H12 -3.175,1.905; H13 -3.175,3.175; H14 -3.175,4.445; H15 -3.175,5.715; H16 -3.175,6.985; H17 -3.175,8.255; H18 -3.175,9.525; H19 -3.175,10.795; H20 -3.175,12.065; J1 -1.905,-12.065; J2 -1.905,-10.795; J3 -1.905,-9.525; J4 -1.905,-8.255; J5 -1.905,-6.985; J6 -1.905,-5.715; J7 -1.905,-4.445; J8 -1.905,-3.175; J9 -1.905,-1.905; J10 -1.905,-0.635; J11 -1.905,0.635; J12 -1.905,1.905; J13 -1.905,3.175; J14 -1.905,4.445; J15 -1.905,5.715; J16 -1.905,6.985; J17 -1.905,8.255; J18 -1.905,9.525; J19 -1.905,10.795; J20 -1.905,12.065; K1 -0.635,-12.065; K2 -0.635,-10.795; K3 -0.635,-9.525; K4 -0.635,-8.255; K5 -0.635,-6.985; K6 -0.635,-5.715; K7 -0.635,-4.445; K8 -0.635,-3.175; K9 -0.635,-1.905; K10 -0.635,-0.635; K11 -0.635,0.635; K12 -0.635,1.905; K13 -0.635,3.175; K14 -0.635,4.445; K15 -0.635,5.715; K16 -0.635,6.985; K17 -0.635,8.255; K18 -0.635,9.525; K19 -0.635,10.795; K20 -0.635,12.065; L1 0.635,-12.065; L2 0.635,-10.795; L3 0.635,-9.525; L4 0.635,-8.255; L5 0.635,-6.985; L6 0.635,-5.715; L7 0.635,-4.445; L8 0.635,-3.175; L9 0.635,-1.905; L10 0.635,-0.635; L11 0.635,0.635; L12 0.635,1.905; L13 0.635,3.175; L14 0.635,4.445; L15 0.635,5.715; L16 0.635,6.985; L17 0.635,8.255; L18 0.635,9.525; L19 0.635,10.795; L20 0.635,12.065; M1 1.905,-12.065; M2 1.905,-10.795; M3 1.905,-9.525; M4 1.905,-8.255; M5 1.905,-6.985; M6 1.905,-5.715; M7 1.905,-4.445; M8 1.905,-3.175; M9 1.905,-1.905; M10 1.905,-0.635; M11 1.905,0.635; M12 1.905,1.905; M13 1.905,3.175; M14 1.905,4.445; M15 1.905,5.715; M16 1.905,6.985; M17 1.905,8.255; M18 1.905,9.525; M19 1.905,10.795; M20 1.905,12.065; N1 3.175,-12.065; N2 3.175,-10.795; N3 3.175,-9.525; N4 3.175,-8.255; N5 3.175,-6.985; N6 3.175,-5.715; N7 3.175,-4.445; N8 3.175,-3.175; N9 3.175,-1.905; N10 3.175,-0.635; N11 3.175,0.635; N12 3.175,1.905; N13 3.175,3.175; N14 3.175,4.445; N15 3.175,5.715; N16 3.175,6.985; N17 3.175,8.255; N18 3.175,9.525; N19 3.175,10.795; N20 3.175,12.065; P1 4.445,-12.065; P2 4.445,-10.795; P3 4.445,-9.525; P4 4.445,-8.255; P5 4.445,-6.985; P6 4.445,-5.715; P7 4.445,-4.445; P8 4.445,-3.175; P9 4.445,-1.905; P10 4.445,-0.635; P11 4.445,0.635; P12 4.445,1.905; P13 4.445,3.175; P14 4.445,4.445; P15 4.445,5.715; P16 4.445,6.985; P17 4.445,8.255; P18 4.445,9.525; P19 4.445,10.795; P20 4.445,12.065; R1 5.715,-12.065; R2 5.715,-10.795; R3 5.715,-9.525; R4 5.715,-8.255; R5 5.715,-6.985; R6 5.715,-5.715; R7 5.715,-4.445; R8 5.715,-3.175; R9 5.715,-1.905; R10 5.715,-0.635; R11 5.715,0.635; R12 5.715,1.905; R13 5.715,3.175; R14 5.715,4.445; R15 5.715,5.715; R16 5.715,6.985; R17 5.715,8.255; R18 5.715,9.525; R19 5.715,10.795; R20 5.715,12.065; T1 6.985,-12.065; T2 6.985,-10.795; T3 6.985,-9.525; T4 6.985,-8.255; T5 6.985,-6.985; T6 6.985,-5.715; T7 6.985,-4.445; T8 6.985,-3.175; T9 6.985,-1.905; T10 6.985,-0.635; T11 6.985,0.635; T12 6.985,1.905; T13 6.985,3.175; T14 6.985,4.445; T15 6.985,5.715; T16 6.985,6.985; T17 6.985,8.255; T18 6.985,9.525; T19 6.985,10.795; T20 6.985,12.065; U1 8.255,-12.065; U2 8.255,-10.795; U3 8.255,-9.525; U4 8.255,-8.255; U5 8.255,-6.985; U6 8.255,-5.715; U7 8.255,-4.445; U8 8.255,-3.175; U9 8.255,-1.905; U10 8.255,-0.635; U11 8.255,0.635; U12 8.255,1.905; U13 8.255,3.175; U14 8.255,4.445; U15 8.255,5.715; U16 8.255,6.985; U17 8.255,8.255; U18 8.255,9.525; U19 8.255,10.795; U20 8.255,12.065; V1 9.525,-12.065; V2 9.525,-10.795; V3 9.525,-9.525; V4 9.525,-8.255; V5 9.525,-6.985; V6 9.525,-5.715; V7 9.525,-4.445; V8 9.525,-3.175; V9 9.525,-1.905; V10 9.525,-0.635; V11 9.525,0.635; V12 9.525,1.905; V13 9.525,3.175; V14 9.525,4.445; V15 9.525,5.715; V16 9.525,6.985; V17 9.525,8.255; V18 9.525,9.525; V19 9.525,10.795; V20 9.525,12.065; W1 10.795,-12.065; W2 10.795,-10.795; W3 10.795,-9.525; W4 10.795,-8.255; W5 10.795,-6.985; W6 10.795,-5.715; W7 10.795,-4.445; W8 10.795,-3.175; W9 10.795,-1.905; W10 10.795,-0.635; W11 10.795,0.635; W12 10.795,1.905; W13 10.795,3.175; W14 10.795,4.445; W15 10.795,5.715; W16 10.795,6.985; W17 10.795,8.255; W18 10.795,9.525; W19 10.795,10.795; W20 10.795,12.065; Y1 12.065,-12.065; Y2 12.065,-10.795; Y3 12.065,-9.525; Y4 12.065,-8.255; Y5 12.065,-6.985; Y6 12.065,-5.715; Y7 12.065,-4.445; Y8 12.065,-3.175; Y9 12.065,-1.905; Y10 12.065,-0.635; Y11 12.065,0.635; Y12 12.065,1.905; Y13 12.065,3.175; Y14 12.065,4.445; Y15 12.065,5.715; Y16 12.065,6.985; Y17 12.065,8.255; Y18 12.065,9.525; Y19 12.065,10.795; Y20 12.065,12.065
DCK5 = smd 1.168 x 0.356: 1 -1.041,0.65; 2 -1.041,0; 3 -1.041,-0.65; 4 1.041,-0.65; 5 1.041,0.65
USB-AB-MICRO-SMD = smd 1.4 x 0.4: D+ 2.85,0; D- 2.85,0.65; GND 2.85,-1.3; ID 2.85,-0.65; VBUS 2.85,1.3 | smd 1.9 x 2.2: SHIELD1 0,4; SHIELD4 0,-4 | smd 1.9 x 2: SHIELD2 0,1.25; SHIELD3 0,-1.25
CM200C-32.768KAZF-UT = smd 1.3 x 1.9: 1 -2.857,-1.587; 2 -2.857,1.613; 3 2.643,-1.587; 4 2.643,1.613
445C33D24M00000 = smd 1.8 x 2.4: 1 -1.905,0; 2 1.895,0

### Placement (x,y rotation side)
C1  10.16,21.59 90 top
C2  8.89,15.88 0 top
C3  11.43,21.59 270 top
C4  29.37,9.53 270 bottom
C5  29.37,14.61 90 bottom
C6  29.37,12.06 270 bottom
C7  29.37,17.14 270 bottom
C8  10.16,19.05 270 top
C9  8.89,19.05 90 top
J1  15.88,14.61 90 top
POWER  22.86,2.54 0 top
PWR  15.24,16.67 270 top
R1  16.51,19.05 90 top
R2  17.78,19.05 90 top
R3  19.05,19.05 90 top
R4  20.32,19.05 90 top
R5  22.86,12.7 90 top
R6  17.62,12.86 90 top
R7  17.3,14.61 180 top
R8  4.45,1.11 180 bottom
R9  15.24,19.05 90 top
R10  7.62,19.05 90 top
R13  2.54,19.05 270 top
R14  3.81,19.05 270 top
R15  5.08,19.05 270 top
R16  6.35,19.05 90 top
R17  2.54,21.59 270 top
R18  3.81,21.59 270 top
R19  5.08,21.59 90 top
R20  6.35,21.59 90 top
R21  2.54,25.4 270 top
R22  3.81,25.4 270 top
R23  6.35,25.4 270 top
R24  7.62,25.4 270 top
R25  8.89,21.59 270 top
R26  7.62,21.59 90 top
R27  5.08,25.4 270 top
R28  7.62,27.78 90 top
R29  6.99,1.11 180 bottom
RESET  22.86,6.35 180 top
U1  19.84,13.18 90 top
U2  15.24,15.24 90 bottom
U3  17.94,4.45 180 top
USB0  25.08,28.26 270 top
USB1  14.61,28.26 270 top
USR0  16.51,16.67 270 top
USR1  17.78,16.67 270 top
USR2  19.05,16.67 270 top
USR3  20.32,16.67 270 top
Y1  25.08,16.51 180 top
Y2  27.97,10.79 90 top

### Tracks (layer width: path | path; a pad name or v marks a point on that pad's centre or on a via)
3.3V  (via drill 0.33)
  Top 0.33: R17.2 2.54,20.32 3.81,20.32 | 3.81,20.32 R18.2 3.81,20.32 | 3.81,20.32 6.35,20.32 | 6.35,20.32 7.62,20.32 | 7.62,20.32 8.89,20.32 | 8.89,20.32 9.68,20.32 | 9.68,20.32 10.16,20.32 | 10.16,20.32 9.68,20.32 | 9.68,20.32 8.89,20.32 | 8.89,20.32 9.68,20.32 | 9.68,20.32 10.16,20.32 | R25.2 8.89,20.32 | R10.2 7.62,20.32 | C1.1 | v3.81,15.24 4.45,14.61 10.79,14.61 | C1.1 | C1.1 10.16,20.32 | C8.1 10.16,20.32 | C3.2 | C3.2 v11.43,20.32 10.79,20.32 | 10.79,20.32 10.79,15.88 | 10.79,15.88 10.79,14.61 | 10.79,20.32 10.16,20.32 | C2.2 10.79,15.88 | 10.79,14.61 R7.2 16.67,14.53 16.67,13.81 16.99,13.49 17.14,13.49 | 20.8,14.46 U1.4 20.78,13.51 | 17.14,13.49 17.46,13.49 R6.2 | 20.78,13.51 20.8,13.49 22.86,13.49 R5.2 | 20.78,13.51 17.14,13.51 17.14,13.49 | R16.2 | R16.2 6.35,20.32 | v3.81,8.89 4.97,8.89 J1.VCC
  Bottom 0.33: U2.V20 27.3,24.13 | 27.3,24.13 U2.U20 27.3,24.13 | 11.43,25.08 11.75,25.4 16.19,25.4 16.51,25.72 16.51,26.35 16.83,26.67 19.05,26.67 22.07,26.67 | 22.07,26.67 25.08,26.67 25.4,26.35 25.4,25.72 25.4,24.45 25.72,24.13 27.3,24.13 | 22.07,26.67 21.59,26.67 | v3.81,8.89 v3.81,15.24 | 11.43,25.08 | 11.43,25.08 v11.43,20.32
BATT_LED_2  (via drill 0.33)
  Top 0.152: v7.62,22.86 R26.2
  Bottom 0.152: U2.T5 v7.62,22.86
EQEP_1A  (via drill 0.33)
  Top 0.152: R27.2 v5.08,24.13
  Bottom 0.152: v5.08,24.13 U2.V2
EQEP_1B  (via drill 0.33)
  Top 0.152: v6.35,27.94 7.62,27.94 R28.2
  Bottom 0.152: v6.35,27.94 6.35,25.24 U2.V3
GND  (via drill 0.33)
  other vias: 10.16,29.21 11.43,29.21 12.7,29.21 13.97,29.21 15.24,29.21 16.51,29.21 17.78,29.21 19.05,29.21 20.32,29.21 21.59,29.21 22.86,29.21 24.13,29.21 25.4,29.21 26.67,29.21 27.94,29.21 29.21,29.21 27.94,24.13 29.21,24.13 29.21,25.4 29.21,26.67 29.21,22.86 29.21,21.59 29.21,20.32 27.94,21.59 27.94,22.86 29.21,19.05 8.89,26.67 10.16,26.67 2.54,29.21 1.27,29.21 1.27,27.94 1.27,26.67 1.27,25.4 1.27,24.13 1.27,22.86 1.27,21.59 1.27,20.32 1.27,19.05 1.27,17.78 1.27,16.51 2.54,16.51 3.81,16.51 5.08,16.51 1.27,12.7 2.54,12.7 5.08,15.24 10.16,13.97 11.43,13.97 12.7,13.97 13.97,13.97 13.97,12.7 12.7,12.7 11.43,12.7 10.16,12.7 7.62,1.27 8.89,1.27 10.16,1.27 11.43,1.27 2.54,11.43 1.27,11.43 2.54,10.16 1.27,6.35 1.27,5.08 1.27,3.81 1.27,2.54 2.54,2.54 2.54,3.81 2.54,5.08 3.81,5.08 3.81,3.81 3.81,2.54 3.81,1.27 15.24,1.27 16.51,1.27 17.78,1.27 19.05,1.27 20.32,1.27 21.59,1.27 22.86,1.27 24.13,1.27 29.21,1.27 27.94,1.27 27.94,5.08 3.81,29.21 5.08,29.21 6.35,29.21 7.62,29.21 8.89,27.94 8.89,29.21 27.94,26.67 26.67,22.86 26.67,21.59 26.67,19.05 12.7,22.86 25.4,17.78 10.16,27.94 12.7,27.94 24.13,27.94 25.4,27.94 27.94,27.94 29.21,27.94 24.13,15.24 12.7,21.59 12.7,20.32 16.51,27.94 17.78,27.94 19.05,27.94 21.59,27.94 22.86,27.94 1.27,1.27 2.54,1.27 1.27,15.24 2.54,15.24 2.54,13.97 1.27,13.97 13.97,20.32 12.7,1.27 3.81,7.62 2.54,7.62 2.54,6.35 3.81,6.35 21.59,3.81 22.86,3.81 24.13,3.81 25.4,3.81 13.97,1.27 11.43,11.43 12.7,11.43 13.97,11.43 24.13,12.7 24.13,11.43 25.4,1.27 26.67,1.27 6.35,16.51 29.21,6.35 29.21,5.08 29.21,3.81 29.21,2.54 11.43,17.78 12.7,17.78 11.43,19.05 12.7,19.05 13.97,19.05 13.97,17.78 12.7,16.51 11.43,16.51 11.43,15.24 12.7,15.24 13.97,15.24 13.97,16.51 15.24,15.24 21.59,16.51 25.4,15.24 24.13,13.97 25.4,13.97 25.4,12.7 21.59,12.7 25.4,11.43 12.7,24.13 22.86,24.13 12.7,7.62 24.13,7.62 21.59,5.08 16.51,24.13 15.24,22.86 17.78,7.62 19.05,7.62 13.97,7.62 13.97,6.35 11.43,26.67 11.43,27.94 2.54,27.94 3.81,27.94 5.08,27.94 5.08,26.67 3.81,26.67 2.54,26.67 10.16,17.78 10.16,25.4 10.16,24.13 10.16,22.86 1.27,10.16 1.27,8.89 1.27,7.62 2.54,8.89 17.78,25.4 21.59,11.43 17.78,11.43 25.4,7.62 20.32,7.62 20.32,5.08 6.35,8.89 6.35,11.43 7.62,16.51 7.62,15.24 6.35,15.24 6.35,13.97 7.62,13.97
  pour Top (isolate 0.152): 30.48,30.48 0,30.48 0,0 30.48,0
  pour Bottom (isolate 0.152): 30.48,30.48 0,30.48 0,0 30.48,0
I2C0_SCL  (via drill 0.33)
  Top 0.152: 18.9,11.98 U1.1 | U1.1 19.05,11.88 v19.05,12.7 | U1.1 18.9,12.06 18.41,12.06 17.62,12.06 R6.1
  Bottom 0.152: U2.C20 26.67,5.08 22.86,5.08 U2.C16 21.59,6.35 21.59,8.57 21.27,8.89 19.37,8.89 19.05,9.21 v19.05,12.7
I2C0_SDA  (via drill 0.33)  (1 unrouted)
  Top 0.152: 22.86,11.88 22.86,12.22 22.86,11.88 | 22.92,11.88 22.86,11.88 | 22.86,11.88 v22.86,11.43 22.86,12.06 22.23,12.06 20.78,12.06 U1.3
  Bottom 0.152: U2.C19 25.4,6.35 24.13,6.35 U2.C17 22.94,6.27 | 22.86,6.35 22.94,6.27 | v22.86,11.43 22.86,6.35 | 22.86,6.35 22.94,6.27
LCD_DATA_14  (via drill 0.33)
  Top 0.152: v8.89,22.86 R25.1
  Bottom 0.152: v8.89,22.86 8.89,23.81 8.89,25.08 8.57,25.4 7.62,25.4 U2.V4
LDO_PGOOD
  Bottom 0.152: U2.B20 26.67,3.81 26.67,2.54 26.35,2.22 9.37,2.22 8.89,2.7 8.89,3.81 U2.B5
MDIR_2B  (via drill 0.33)
  Top 0.152: R24.2 v7.62,24.13
  Bottom 0.152: v7.62,24.13 U2.U4
MDIR_3A  (via drill 0.33)
  Top 0.152: v6.35,17.78 R16.1
  Bottom 0.152: 6.35,20.32 v6.35,17.78 | U2.R4 6.35,20.32 | 6.35,20.32
MDIR_3B  (via drill 0.33)
  Top 0.152: v5.08,17.78 R15.2
  Bottom 0.152: U2.R3 5.08,20.32 v5.08,17.78
MDIR_4A  (via drill 0.33)
  Top 0.152: v2.54,17.78 R13.2
  Bottom 0.152: U2.R1 2.54,20.32 v2.54,17.78
MDIR_4B  (via drill 0.33)
  Top 0.152: v3.81,17.78 R14.2
  Bottom 0.152: U2.R2 3.81,20.32 v3.81,17.78
N$1  (via drill 0.33)
  Top 0.152: v22.86,21.59 23.02,21.59 23.34,21.91 23.34,22.07 23.34,22.86 23.02,23.18 15.88,23.18 14.76,24.29 14.76,25.25 | 14.76,25.25 USB1.D+ 14.76,25.25
  Bottom 0.152: U2.R17 v22.86,21.59
N$2  (via drill 0.33)
  Top 0.152: v24.13,10.16 23.81,9.84 23.34,9.84 22.7,9.21 20,9.21 19.68,9.53 7.62,9.53 7.08,10.06 J1.CLK
  Bottom 0.152: U2.G17 v24.13,10.16
N$4  (via drill 0.33)
  Top 0.152: v24.13,21.59 23.97,21.59 23.65,21.91 23.65,22.07 23.65,23.02 23.18,23.5 16.03,23.5 15.08,24.45 15.08,25.23 | 15.08,25.23 USB1.D- 15.08,25.23
  Bottom 0.152: U2.R18 v24.13,21.59
N$5  (via drill 0.33)
  Top 0.152: J1.CD/DAT3 6.92,6.76 7.3,7.14 7.3,8.41 7.78,8.89 19.37,8.89 19.68,8.57 23.02,8.57 23.34,8.89 v24.13,8.89
  Bottom 0.152: U2.F17 v24.13,8.89
N$6  (via drill 0.33)
  Top 0.33: USB1.VBUS 15.91,25.87 16.06,26.04 22.23,26.04 v22.86,25.4
  Bottom 0.33: v22.86,25.4 23.81,25.4 24.13,25.08 24.13,22.86 U2.T18
N$7
  Bottom 0.152: U2.B10 13.97,3.81 11.75,3.81 11.43,4.13 11.43,6.03 11.11,6.35 10.48,6.35 10.16,6.67 10.16,7.3 9.84,7.62 9.21,7.62 8.89,7.3 8.89,6.67 8.57,6.35 6.67,6.35 6.35,6.03 6.35,4.13 6.03,3.81 5.4,3.81 5.08,3.49 5.08,0.95 R8.2
N$8
  Top 0.152: R1.1 USR0.A
N$9
  Top 0.152: R2.1 USR1.A
N$10
  Top 0.152: R3.1 USR2.A
N$11
  Top 0.152: R4.1 USR3.A
N$12
  Bottom 0.152: U2.D19 26.67,7.62 27.62,7.62 28.57,6.67 28.57,2.22 28.26,1.91 9.21,1.91 8.57,2.54 7.94,2.54 7.62,2.86 7.62,4.76 7.94,5.08 8.89,5.08 U2.C6
N$13  (1 unrouted)
N$26  (via drill 0.33)
  Top 0.152: Y1.2 28.12,15.06 28.12,16.33 v27.94,16.51
  Bottom 0.152: C7.1 28.81,17.14 U2.M20 v27.94,16.51
N$27  (via drill 0.33)
  Top 0.152: Y1.1 27.94,17.78 26.67,16.51 v26.67,15.24
  Bottom 0.152: C5.1 28.81,14.61 U2.K20 v26.67,15.24
N$28
  Top 0.33: R7.1 18.9,14.61 U1.5
N$31
  Bottom 0.152: U2.L20 29.37,15.88 | 29.37,15.88 C7.2 | C5.2 29.37,15.88
N$32  (via drill 0.33)
  Top 0.152: Y2.2 27.93,12.69 v26.67,11.43
  Bottom 0.152: C6.1 28.81,12.06 U2.H20 v26.67,11.43
N$33  (via drill 0.33)
  Top 0.152: Y2.1 27.94,8.89 v26.67,10.16
  Bottom 0.152: C4.2 28.81,9.53 U2.F20 v26.67,10.16
N$34
  Bottom 0.152: U2.G20 29.37,10.79 | 29.37,10.79 C6.2 | 29.37,10.79 C4.1
N$70  (via drill 0.33)  (1 unrouted)
  Top 0.152: J1.DAT1 5.05,13.34 | v20.32,10.16 20,10.16 7.94,10.16 7.62,10.48 7.62,13.02 7.3,13.34 5.17,13.34
  Bottom 0.152: U2.G15 v20.32,10.16
N$74  (via drill 0.33)
  Top 0.152: J1.CMD 6.28,7.87 7.62,9.21 19.53,9.21 19.84,8.89 22.86,8.89 23.5,9.53 24.77,9.53 v25.4,10.16
  Bottom 0.152: U2.G18 v25.4,10.16
N$75  (via drill 0.33)
  Top 0.152: v16.51,6.35 15.47,6.35 J1.CD2
  Bottom 0.152: U2.C15 20.32,6.35 v16.51,6.35
N$77  (via drill 0.33)
  Top 0.152: J1.DAT0 6.94,12.27 7.3,11.91 7.3,10.32 7.78,9.84 19.84,9.84 20.16,9.53 20.95,9.53 v21.59,10.16
  Bottom 0.152: U2.G16 v21.59,10.16
N$131
  Bottom 0.152: U2.B4 6.99,4.13 6.35,3.49 6.35,0.95 R29.1
NTE  (via drill 0.33)
  Top 0.152: J1.DAT2 7.25,5.67 7.62,6.03 7.62,8.26 7.94,8.57 19.21,8.57 19.53,8.26 24.77,8.26 v25.4,8.89
  Bottom 0.152: U2.F18 v25.4,8.89
PMIC_INT
  Bottom 0.152: U2.B19 U2.B18
PMIC_NWAKEUP
  Bottom 0.152: U2.A19 25.4,2.54 10.48,2.54 10.16,2.86 10.16,6.03 9.84,6.35 9.21,6.35 8.57,5.71 U2.C5
PMIC_PGOOD  (via drill 0.33)
  Top 0.152: v27.94,2.54 27.94,4.13 27.62,4.45 20.48,4.45 20.32,4.45 | U3.2 20.32,4.45 | 20.32,4.45 v20.32,3.81
  Bottom 0.152: U2.B15 v20.32,3.81 | U2.A20 v27.94,2.54
PWR  (via drill 0.33)
  Top 0.152: v27.94,6.35 28.57,5.71 28.57,2.22 28.26,1.91 26.64,1.91 POWER.2
  Bottom 0.152: U2.D20 v27.94,6.35
RESET  (via drill 0.33)
  Top 0.152: R10.1 C9.1 v8.89,17.78 | RESET.2 17.99,6.35 U3.4 15.57,5.09 15.24,4.76 v15.24,3.81
  Bottom 0.152: v15.24,3.81 15.24,4.76 | 15.24,4.76 v15.24,3.81 | v15.24,3.81 U2.A10 | v15.24,3.81 15.24,4.76 | 15.24,4.76 14.92,5.08 13.02,5.08 12.7,5.4 12.7,6.03 12.38,6.35 11.75,6.35 11.43,6.67 11.43,7.3 11.11,7.62 10.48,7.62 10.16,7.94 10.16,11.11 9.84,11.43 9.21,11.43 8.89,11.75 v8.89,17.78
SERVO_EN  (via drill 0.33)
  Top 0.152: v6.35,24.13 R23.2
  Bottom 0.152: U2.U3 v6.35,24.13
SVO5  (via drill 0.33)
  Top 0.152: v5.08,22.86 R19.2
  Bottom 0.152: U2.T3 v5.08,22.86
SVO6  (via drill 0.33)
  Top 0.152: v6.35,22.86 R20.2
  Bottom 0.152: U2.T4 v6.35,22.86
SVO7  (via drill 0.33)
  Top 0.152: v2.54,22.86 R17.1
  Bottom 0.152: U2.T1 v2.54,22.86
SVO8  (via drill 0.33)
  Top 0.152: v3.81,22.86 R18.1
  Bottom 0.152: U2.T2 v3.81,22.86
UART5_RX  (via drill 0.33)
  Top 0.152: R22.2 v3.81,24.13
  Bottom 0.152: v3.81,24.13 U2.U2
UART5_TX  (via drill 0.33)
  Top 0.152: R21.2 v2.54,24.13
  Bottom 0.152: U2.U1 v2.54,24.13
USB0_DM  (via drill 0.33)
  Top 0.152: USB0.D- 25.72,25.55 25.72,24.61 25.56,24.45 25.56,20.32 25.56,18.73 25.08,18.26 24.92,18.26 24.45,18.26 24.13,17.94 v24.13,17.78
  Bottom 0.152: U2.N18 v24.13,17.78
USB0_DP  (via drill 0.33)
  Top 0.152: USB0.D+ 25.08,24.61 25.24,24.45 25.24,20.32 25.24,18.89 24.92,18.57 24.45,18.57 24.13,18.89 v24.13,19.05
  Bottom 0.152: v24.13,19.05 U2.N17
USB0_ID  (via drill 0.33)
  Top 0.152: USB0.ID 24.43,26.34 24.77,26.67 26.67,26.67 27.3,26.04 28.26,26.04 28.57,25.72 28.57,20.64 28.26,20.32 v27.94,20.32
  Bottom 0.152: v27.94,20.32 22.86,20.32 U2.P16
USB1_ID  (via drill 0.33)
  Top 0.152: USB1.ID 13.96,22.56 14.29,22.23 21.27,22.23 21.59,21.91 v21.59,20.32
  Bottom 0.152: U2.P17 22.86,19.05 21.91,19.05 21.59,19.37 v21.59,20.32
USB_DC  (via drill 0.33)
  Top 0.33: v26.67,25.4 USB0.VBUS
  Bottom 0.33: U2.Y8 U2.Y9 13.34,28.26 13.65,28.57 26.35,28.57 26.67,28.26 v26.67,25.4 28.26,25.4 28.57,25.08 28.57,18.1 28.26,17.78 26.99,17.78 26.67,17.46 26.67,16.83 26.35,16.51 23.18,16.51 22.86,16.83 22.86,17.46 22.54,17.78 21.91,17.78 21.59,18.1 21.59,18.73 20.95,19.37 U2.P15
USR0  (via drill 0.33)
  Top 0.152: v16.51,20.32 R1.2
  Bottom 0.152: v16.51,20.32 16.51,21.27 16.83,21.59 17.46,21.59 17.78,21.91 17.78,23.81 18.1,24.13 18.73,24.13 19.05,24.45 19.05,25.08 19.37,25.4 20.64,25.4 20.95,25.08 U2.V15
USR1  (via drill 0.33)
  Top 0.152: v17.78,20.32 R2.2
  Bottom 0.152: v17.78,20.32 17.78,21.27 18.1,21.59 18.73,21.59 19.05,21.91 19.05,23.81 19.37,24.13 20.64,24.13 20.95,23.81 U2.U15
USR2  (via drill 0.33)
  Top 0.152: v19.05,20.32 R3.2
  Bottom 0.152: v19.05,20.32 19.05,21.27 19.37,21.59 20,21.59 20.64,22.23 U2.T15
USR3  (via drill 0.33)
  Top 0.152: v20.32,20.32 R4.2
  Bottom 0.152: U2.V16 21.59,24.13 21.59,21.91 21.27,21.59 20.64,21.59 20.32,21.27 v20.32,20.32
VDD_3V3AUX  (via drill 0.33)
  Top 0.152: R9.2 15.24,19.68 12.38,19.68 12.06,20 12.06,26.67 12.38,26.99 14.92,26.99 v15.24,26.67
  Bottom 0.152: U2.Y11 v15.24,26.67
VDD_RTC  (via drill 0.33)
  Top 0.152: v17.78,3.81 17.77,3.79 U3.5
  Bottom 0.152: U2.E14 19.37,8.26 18.73,8.89 16.83,8.89 16.51,8.57 16.51,7.94 16.19,7.62 15.56,7.62 15.24,7.3 15.24,5.4 15.56,5.08 16.19,5.08 16.51,4.76 16.51,4.18 U3.5 17.77,3.79 v17.78,3.81